# EAGLE design Pot4_2_MCP3008 (EAGLE 7.2.0)
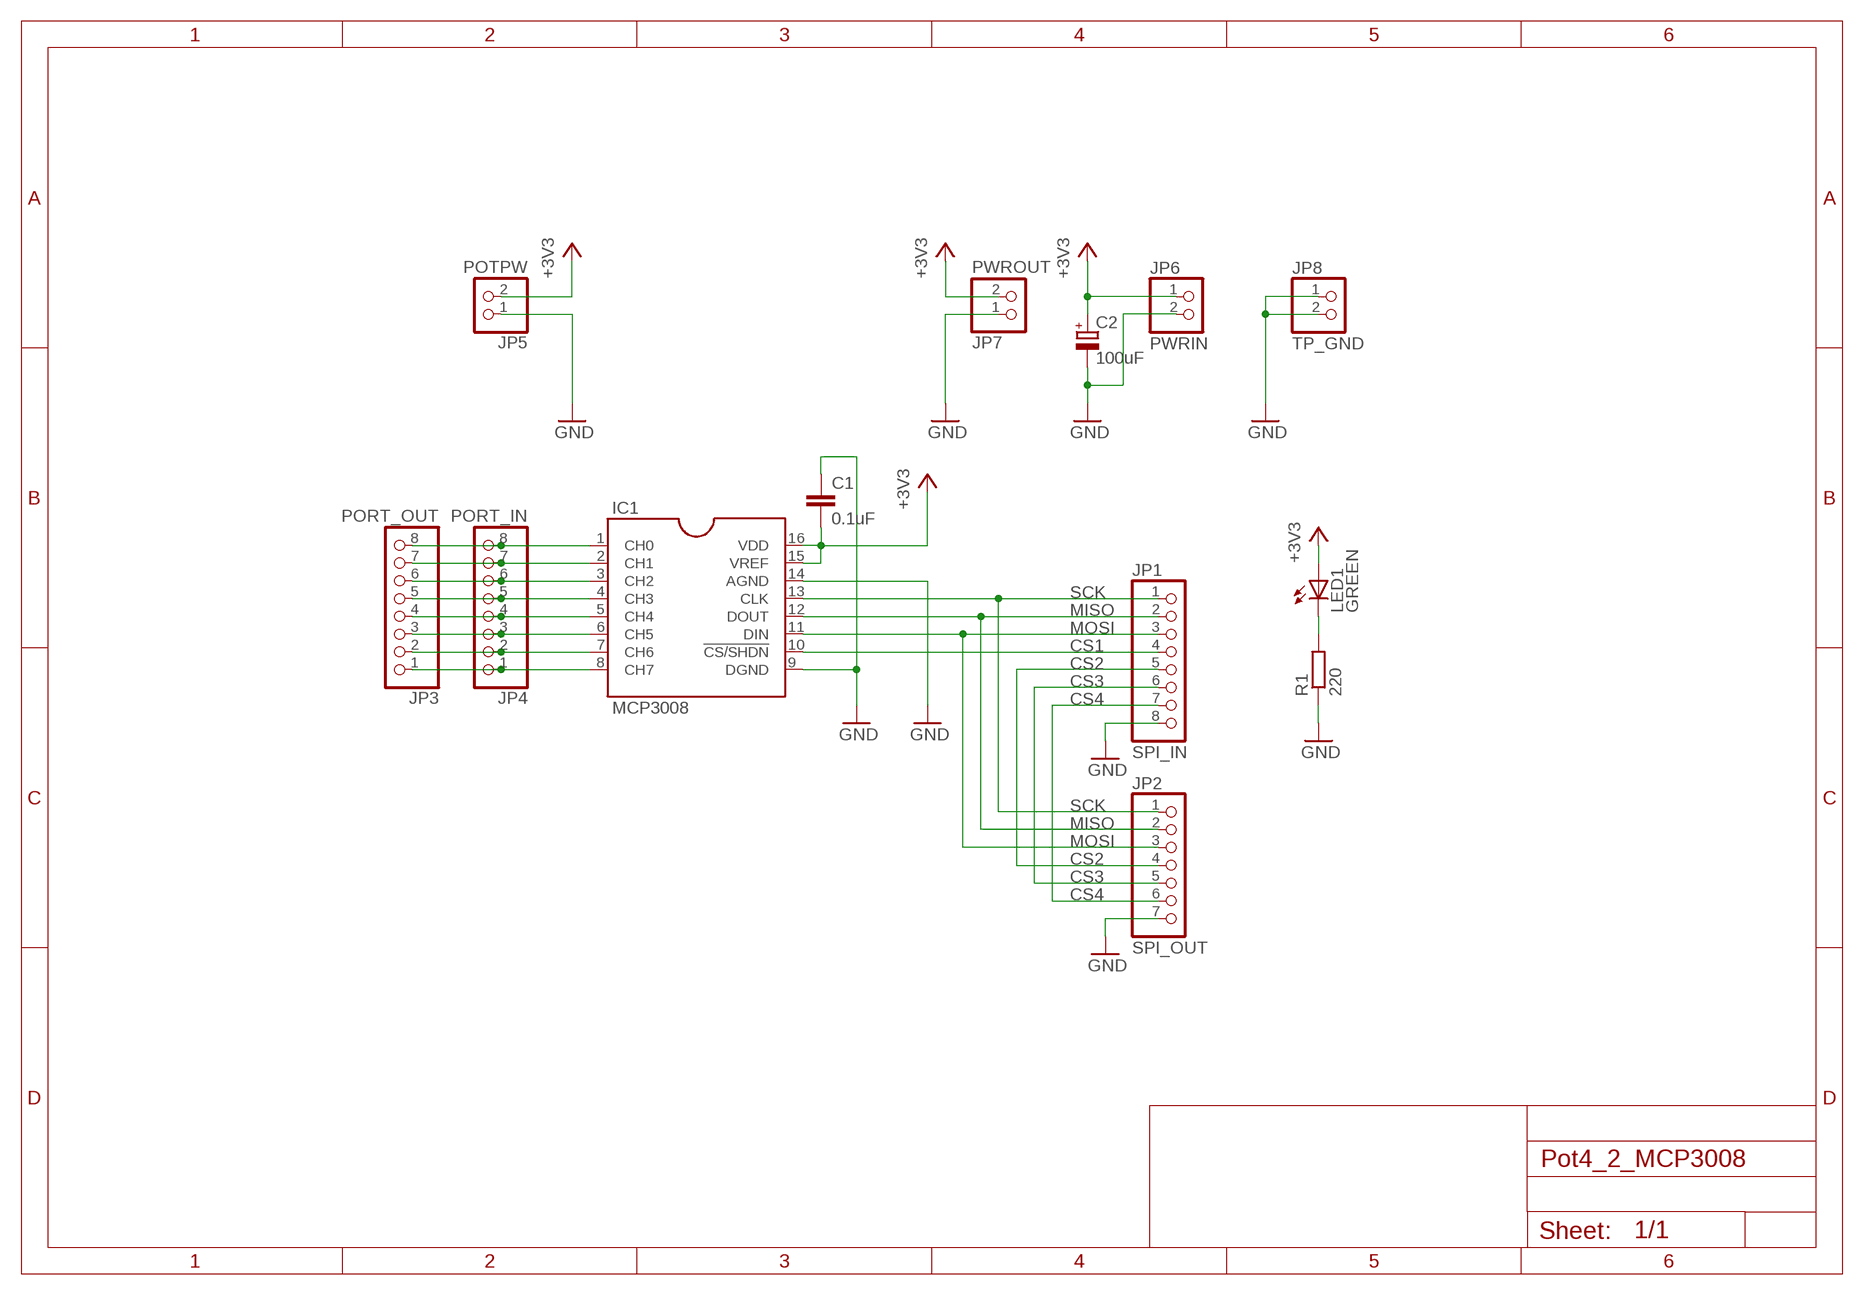
[diagram p0: schematic, sheet 1]

## Parts
C1  0.1uF  C-EU025-024X044  [C025-024X044]
C2  100uF  CPOL-EUE2.5-7  [E2,5-7]
IC1  MCP3008  [MCP3008]
JP1  SPI_IN  PINHD-1X8/90  [1X08/90]
JP2  SPI_OUT  PINHD-1X7/90  [1X07/90]
JP3  PORT_OUT  PINHD-1X8  [1X08]
JP4  PORT_IN  PINHD-1X8/90  [1X08/90]
JP5  POTPW  PINHD-1X2/90  [1X02/90]
JP6  PWRIN  PINHD-1X2/90  [1X02/90]
JP7  PWROUT  PINHD-1X2/90  [1X02/90]
JP8  TP_GND  PINHD-1X2  [1X02]
LED1  GREEN  LED3MM  [LED3MM]
R1  220  R-EU_0207/7  [0207/7]

## Nets
+3V3: C1.2 C2.+ IC1.15(VREF) IC1.16(VDD) JP5.2 JP6.1 JP7.2 LED1.A
CS1: IC1.10(!CS/SHDN) JP1.4
CS2: JP1.5 JP2.4
CS3: JP1.6 JP2.5
CS4: JP1.7 JP2.6
GND: C1.1 C2.- IC1.9(DGND) IC1.14(AGND) JP1.8 JP2.7 JP5.1 JP6.2 JP7.1 JP8.1 JP8.2 R1.1
MISO: IC1.12(DOUT) JP1.2 JP2.2
MOSI: IC1.11(DIN) JP1.3 JP2.3
N$1: IC1.1(CH0) JP3.8 JP4.8
N$2: IC1.2(CH1) JP3.7 JP4.7
N$3: IC1.3(CH2) JP3.6 JP4.6
N$4: IC1.4(CH3) JP3.5 JP4.5
N$5: IC1.5(CH4) JP3.4 JP4.4
N$6: IC1.6(CH5) JP3.3 JP4.3
N$7: IC1.7(CH6) JP3.2 JP4.2
N$8: IC1.8(CH7) JP3.1 JP4.1
N$9: LED1.K(C) R1.2
SCK: IC1.13(CLK) JP1.1 JP2.1

## Library data of the parts
C1 = rcl:C-EU: CAPACITOR, European symbol
C2 = rcl:CPOL-EU: POLARIZED CAPACITOR, European symbol
IC1 = mylib2:MCP3008
JP1 JP3 JP4 = pinhead:PINHD-1X8: PIN HEADER
JP2 = pinhead:PINHD-1X7: PIN HEADER
JP5-JP8 = pinhead:PINHD-1X2: PIN HEADER
LED1 = led:LED: LED OSRAM: - CHIPLED LG R971, LG N971, LY N971, LG Q971, LY Q971, LO R971, LY R971 LH N974, LH R974 LS Q976, LO Q976, LY Q976 LO Q996 - Hyper CHIPLED LW Q18S LB Q993, LB Q99A, LB R99A - SideLED LS A670, LO A670, LY A670, LG A670, LP A670 LB A673, LV A673, LT A673, LW A673 LH A674 LY A675 LS A676, LA A676, LO A676, LY A676, LW A676 LS A679, LY A679, LG A679 - Hyper Micro SIDELED® LS Y876, LA Y876, LO Y876, LY Y876 LT Y87S - SmartLED LW L88C, LW L88S LB L89C, LB L89S, LG L890 LS L89K, LO L89K, LY L89K LS L896, LA L896, LO L896, LY L896 - TOPLED LS T670, LO T670, LY T670, LG T670, LP T670 LSG T670, LSP T670, LSY T670, LOP T670, LYG T670 LG T671, LOG T671, LSG T671 LB T673, LV T673, LT T673, LW T673 LH T674 LS T676, LA T676, LO T676, LY T676, LB T676, LH T676, LSB T676, LW T676 LB T67C, LV T67C, LT T67C, LS T67K, LO T67K, LY T67K, LW E67C LS E67B, LA E67B, LO E67B, LY E67B, LB E67C, LV E67C, LT E67C LW T67C LS T679, LY T679, LG T679 LS T770, LO T770, LY T770, LG T770, LP T770 LB T773, LV T773, LT T773, LW T773 LH T774 LS E675, LA E675, LY E675, LS T675 LS T776, LA T776, LO T776, LY T776, LB T776 LHGB T686 LT T68C, LB T68C - Hyper Mini TOPLED® LB M676 - Mini TOPLED Santana® LG M470 LS M47K, LO M47K, LY M47K Source: http://www.osram.convergy.de LUXEON: - LUMILED® LXK2-PW12-R00, LXK2-PW12-S00, LXK2-PW14-U00, LXK2-PW14-V00 LXK2-PM12-R00, LXK2-PM12-S00, LXK2-PM14-U00 LXK2-PE12-Q00, LXK2-PE12-R00, LXK2-PE12-S00, LXK2-PE14-T00, LXK2-PE14-U00 LXK2-PB12-K00, LXK2-PB12-L00, LXK2-PB12-M00, LXK2-PB14-N00, LXK2-PB14-P00, LXK2-PB14-Q00 LXK2-PR12-L00, LXK2-PR12-M00, LXK2-PR14-Q00, LXK2-PR14-R00 LXK2-PD12-Q00, LXK2-PD12-R00, LXK2-PD12-S00 LXK2-PH12-R00, LXK2-PH12-S00 LXK2-PL12-P00, LXK2-PL12-Q00, LXK2-PL12-R00 Source: www.luxeon.com KINGBRIGHT: KA-3528ASYC Source: www.kingbright.com
R1 = rcl:R-EU_: RESISTOR, European symbol

## Board
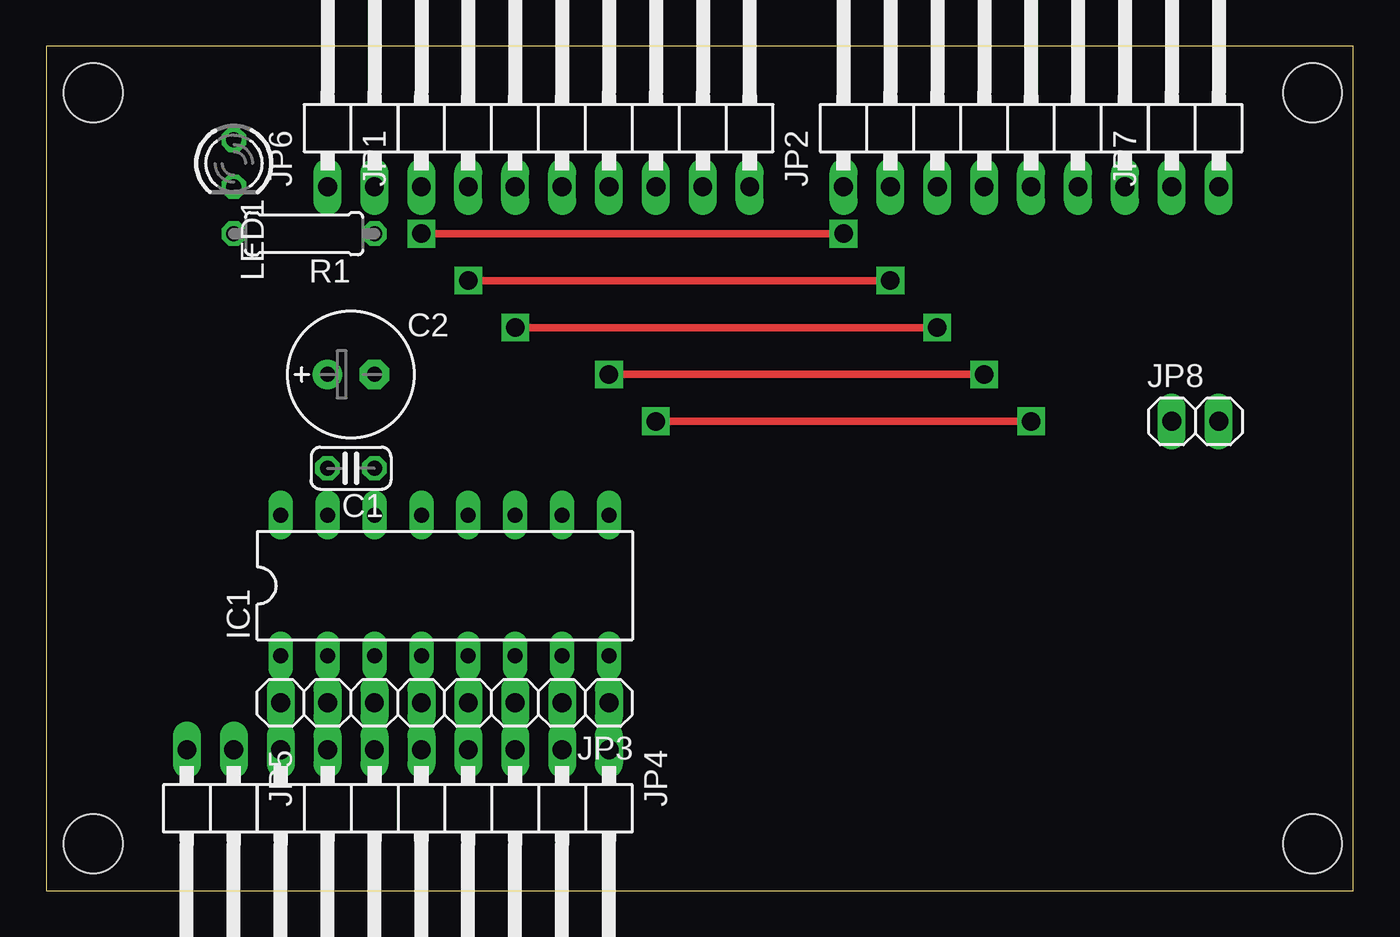
[diagram p1: board, top side]
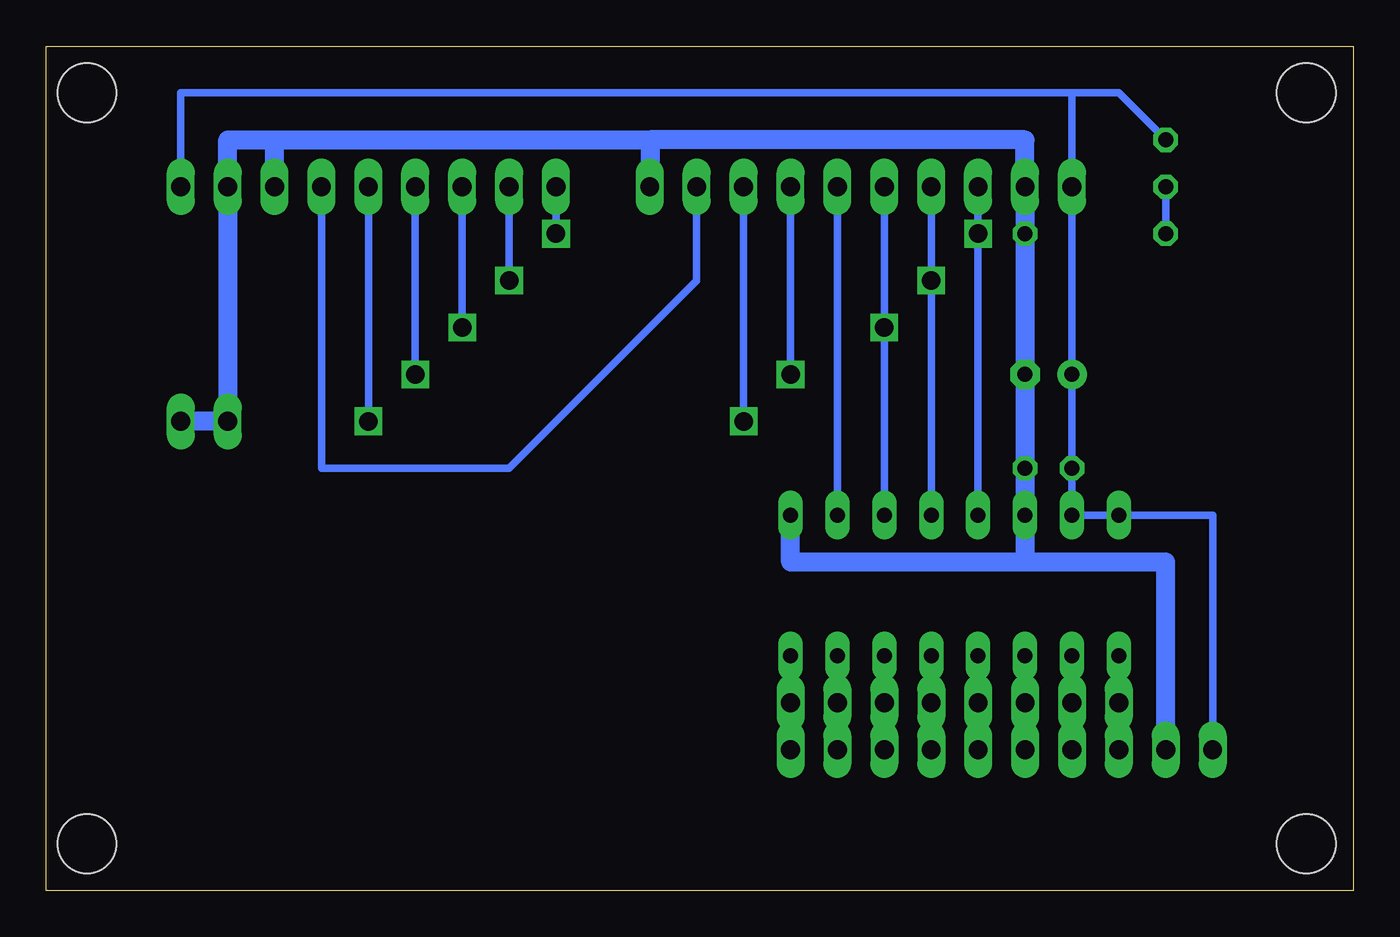
[diagram p2: board, bottom side, seen from below]

Size 70.79 x 45.71 mm. Coordinates in mm from the lower left corner, seen from the top.
Outline: 0,0 70.79,0 70.79,45.71 0,45.71 0,0
Copper layers (1*16): Top 0.035mm / dielectric 1.5mm / Bottom 0.035mm
Design rules "default": minimum track width 10mil, minimum drill 24mil, track to track 8mil, track to pad 8mil, pad to pad 8mil, via to via 8mil, smd to smd 8mil, copper to edge 40mil, drill to drill 8mil, minimum pad ring 10mil, minimum via ring 8mil, stop-mask expansion 4mil, vias tented up to drill 0mil, thermal gap 10mil
Holes 3.2 mm at 2.54,43.18 2.54,2.54 68.58,43.18 68.58,2.54

### Footprints (pad centres in the part's own frame; a part is rotated, then mirrored left to right if it is on the bottom)
C025-024X044 = drill 0.813 octagon: 1 -1.27,0; 2 1.27,0
E2,5-7 = drill 0.813 pad 1.6: + -1.27,0 | drill 0.813 pad 1.6 octagon: - 1.27,0
MCP3008 = drill 0.813 long: 1 -8.89,-3.81; 2 -6.35,-3.81; 3 -3.81,-3.81; 4 -1.27,-3.81; 5 1.27,-3.81; 6 3.81,-3.81; 7 6.35,-3.81; 8 8.89,-3.81; 9 8.89,3.81; 10 6.35,3.81; 11 3.81,3.81; 12 1.27,3.81; 13 -1.27,3.81; 14 -3.81,3.81; 15 -6.35,3.81; 16 -8.89,3.81
1X08/90 = drill 1.016 long: 1 -8.89,-3.81; 2 -6.35,-3.81; 3 -3.81,-3.81; 4 -1.27,-3.81; 5 1.27,-3.81; 6 3.81,-3.81; 7 6.35,-3.81; 8 8.89,-3.81
1X07/90 = drill 1.016 long: 1 -7.62,-3.81; 2 -5.08,-3.81; 3 -2.54,-3.81; 4 0,-3.81; 5 2.54,-3.81; 6 5.08,-3.81; 7 7.62,-3.81
1X08 = drill 1.016 long: 1 -8.89,0; 2 -6.35,0; 3 -3.81,0; 4 -1.27,0; 5 1.27,0; 6 3.81,0; 7 6.35,0; 8 8.89,0
1X02/90 = drill 1.016 long: 1 -1.27,-3.81; 2 1.27,-3.81
1X02 = drill 1.016 long: 1 -1.27,0; 2 1.27,0
LED3MM = drill 0.813 octagon: A -1.27,0; K 1.27,0
0207/7 = drill 0.813 octagon: 1 -3.81,0; 2 3.81,0

### Placement (x,y rotation side)
C1  16.51,22.86 180 top
C2  16.51,27.94 0 top
IC1  21.59,16.51 0 top
JP1  29.21,41.91 0 top
JP2  50.8,41.91 0 top
JP3  21.59,10.16 180 top
JP4  21.59,3.81 180 top
JP5  8.89,3.81 180 top
JP6  16.51,41.91 0 top
JP7  62.23,41.91 0 top
JP8  62.23,25.4 0 top
LED1  10.16,39.37 270 top
R1  13.97,35.56 180 top

### Tracks (layer width: path | path; a pad name or v marks a point on that pad's centre or on a via)
+3V3
  Bottom 0.406: JP5.2 7.62,20.32 IC1.16 IC1.15 C1.2 C2.+ JP6.1 15.24,43.18 | JP7.2 63.5,43.18 15.24,43.18 | LED1.A 12.7,43.18 15.24,43.18
CS1
  Bottom 0.406: JP1.4 IC1.10
CS2  (via drill 1)
  Top 0.406: v30.48,27.94 v50.8,27.94
  Bottom 0.406: JP1.5 v30.48,27.94 | v50.8,27.94 JP2.4
CS3  (via drill 1)
  Top 0.406: v33.02,25.4 v53.34,25.4
  Bottom 0.406: JP1.6 v33.02,25.4 | v53.34,25.4 JP2.5
CS4
  Bottom 0.406: JP2.6 55.88,22.86 45.72,22.86 35.56,33.02 JP1.7
GND
  Bottom 1.016: 38.1,40.64 17.78,40.64 JP6.2 R1.1 C2.- C1.1 IC1.14 17.78,17.78 | 38.1,40.64 JP1.8 | JP2.7 58.42,40.64 | 58.42,40.64 38.1,40.64 | 58.42,40.64 60.96,40.64 JP7.1 JP8.1 JP8.2 | 17.78,17.78 30.48,17.78 IC1.9 | JP5.1 10.16,17.78 17.78,17.78
MISO  (via drill 1)
  Top 0.406: v45.72,33.02 v22.86,33.02
  Bottom 0.406: JP1.2 v22.86,33.02 IC1.12 | JP2.2 v45.72,33.02
MOSI  (via drill 1)
  Top 0.406: v48.26,30.48 v25.4,30.48
  Bottom 0.406: JP1.3 v25.4,30.48 IC1.11 | JP2.3 v48.26,30.48
N$1
  Bottom 0.406: IC1.1 JP3.8 JP4.8
N$2
  Bottom 0.406: JP4.7 JP3.7 IC1.2
N$3
  Bottom 0.406: IC1.3 JP3.6 JP4.6
N$4
  Bottom 0.406: JP4.5 JP3.5 IC1.4
N$5
  Bottom 0.406: IC1.5 JP3.4 JP4.4
N$6
  Bottom 0.406: JP4.3 JP3.3 IC1.6
N$7
  Bottom 0.406: IC1.7 JP3.2 JP4.2
N$8
  Bottom 0.406: JP4.1 JP3.1 IC1.8
N$9
  Bottom 0.406: LED1.K R1.2
SCK  (via drill 1)
  Top 0.406: v43.18,35.56 v20.32,35.56
  Bottom 0.406: JP1.1 v20.32,35.56 IC1.13 | JP2.1 v43.18,35.56